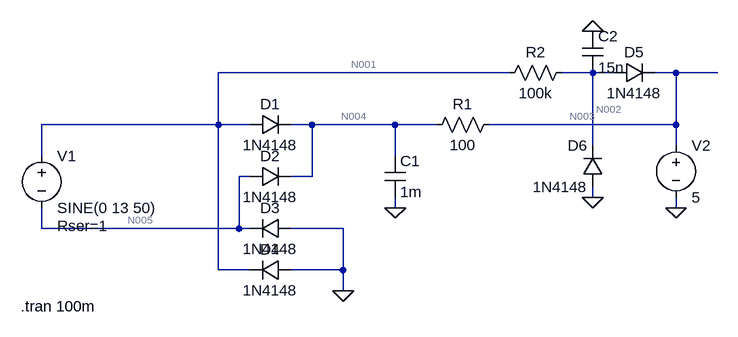
[diagram p0: schematic 50Hz_clock_generator.asc]
50Hz_clock_generator.asc, the LTspice schematic file:
Version 4
SHEET 1 1108 680
WIRE 784 -16 336 -16
WIRE 912 -16 864 -16
WIRE 944 -16 912 -16
WIRE 1040 -16 1008 -16
WIRE 1104 -16 1040 -16
WIRE 336 64 336 -16
WIRE 336 64 64 64
WIRE 384 64 336 64
WIRE 480 64 448 64
WIRE 608 64 480 64
WIRE 672 64 608 64
WIRE 1040 64 1040 -16
WIRE 1040 64 752 64
WIRE 912 96 912 -16
WIRE 1040 96 1040 64
WIRE 64 112 64 64
WIRE 608 112 608 64
WIRE 384 144 368 144
WIRE 480 144 480 64
WIRE 480 144 448 144
WIRE 912 176 912 160
WIRE 608 192 608 176
WIRE 1040 192 1040 176
WIRE 64 224 64 192
WIRE 368 224 368 144
WIRE 368 224 64 224
WIRE 384 224 368 224
WIRE 528 224 448 224
WIRE 336 288 336 64
WIRE 384 288 336 288
WIRE 528 288 528 224
WIRE 528 288 448 288
WIRE 528 320 528 288
FLAG 528 320 0
FLAG 608 192 0
FLAG 912 176 0
FLAG 912 -80 0
FLAG 1040 192 0
SYMBOL voltage 64 96 R0
WINDOW 123 0 0 Left 0
WINDOW 39 24 124 Left 2
SYMATTR SpiceLine Rser=1
SYMATTR InstName V1
SYMATTR Value SINE(0 13 50)
SYMBOL diode 384 80 R270
WINDOW 0 32 32 VTop 2
WINDOW 3 0 32 VBottom 2
SYMATTR InstName D1
SYMATTR Value 1N4148
SYMBOL diode 384 160 R270
WINDOW 0 32 32 VTop 2
WINDOW 3 0 32 VBottom 2
SYMATTR InstName D2
SYMATTR Value 1N4148
SYMBOL diode 448 208 R90
WINDOW 0 0 32 VBottom 2
WINDOW 3 32 32 VTop 2
SYMATTR InstName D3
SYMATTR Value 1N4148
SYMBOL diode 448 272 R90
WINDOW 0 0 32 VBottom 2
WINDOW 3 32 32 VTop 2
SYMATTR InstName D4
SYMATTR Value 1N4148
SYMBOL cap 592 112 R0
SYMATTR InstName C1
SYMATTR Value 1m
SYMBOL diode 944 0 R270
WINDOW 0 32 32 VTop 2
WINDOW 3 0 32 VBottom 2
SYMATTR InstName D5
SYMATTR Value 1N4148
SYMBOL res 880 -32 R90
WINDOW 0 0 56 VBottom 2
WINDOW 3 32 56 VTop 2
SYMATTR InstName R2
SYMATTR Value 100k
SYMBOL diode 928 160 R180
WINDOW 0 24 64 Left 2
WINDOW 3 24 0 Left 2
SYMATTR InstName D6
SYMATTR Value 1N4148
SYMBOL cap 896 -80 R0
SYMATTR InstName C2
SYMATTR Value 15n
SYMBOL res 768 48 R90
WINDOW 0 0 56 VBottom 2
WINDOW 3 32 56 VTop 2
SYMATTR InstName R1
SYMATTR Value 100
SYMBOL voltage 1040 80 R0
WINDOW 123 0 0 Left 0
WINDOW 39 0 0 Left 0
SYMATTR InstName V2
SYMATTR Value 5
TEXT 32 344 Left 2 !.tran 100m

The netlist it stands for:
* 50Hz_clock_generator.asc
V1 N001 N005 SINE(0 13 50) Rser=1
D1 N001 N004 1N4148
D2 N005 N004 1N4148
D3 0 N005 1N4148
D4 0 N001 1N4148
C1 N004 0 1m
D5 N002 N003 1N4148
R2 N002 N001 100k
D6 0 N002 1N4148
C2 0 N002 15n
R1 N003 N004 100
V2 N003 0 5
.model D D
.lib standard.dio
.tran 100m
.backanno
.end

* Results of the author's LTspice run, read from the files saved beside the schematic
* Operating Point, zero values left out:
*   V(n001) = 2.5 V
*   V(n005) = 2.5 V
*   V(n004) = 5 V
*   V(n002) = 2.5 V
*   V(n003) = 5 V
*   I(D6) = -2.523 nA
*   I(D5) = -2.522 nA
*   I(D4) = -2.523 nA
*   I(D3) = -2.523 nA
*   I(D2) = -2.523 nA
*   I(D1) = -2.523 nA
*   I(R1) = 5.045 nA
*   I(V2) = -7.568 nA
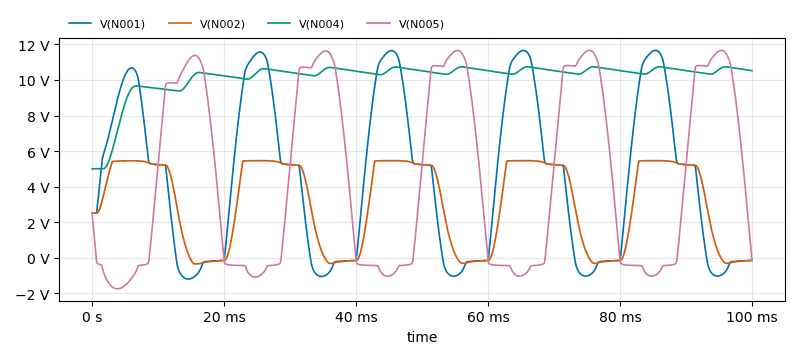
[diagram p1: Transient Analysis of 50Hz_clock_generator.asc, plotted from the saved traces]
* Transient Analysis, 1 run:
*   V(N001): min -1.21 V, max 11.67 V, average 4.328 V, rms 6.239 V, last -154.3 mV
*   V(N002): min -357.4 mV, max 5.458 V, average 3.057 V, rms 3.919 V, last -171.4 mV
*   V(N004): min 5 V, max 10.75 V, average 10.17 V, rms 10.22 V, last 10.53 V
*   V(N005): min -1.758 V, max 11.67 V, average 4.365 V, rms 6.755 V, last -154.3 mV